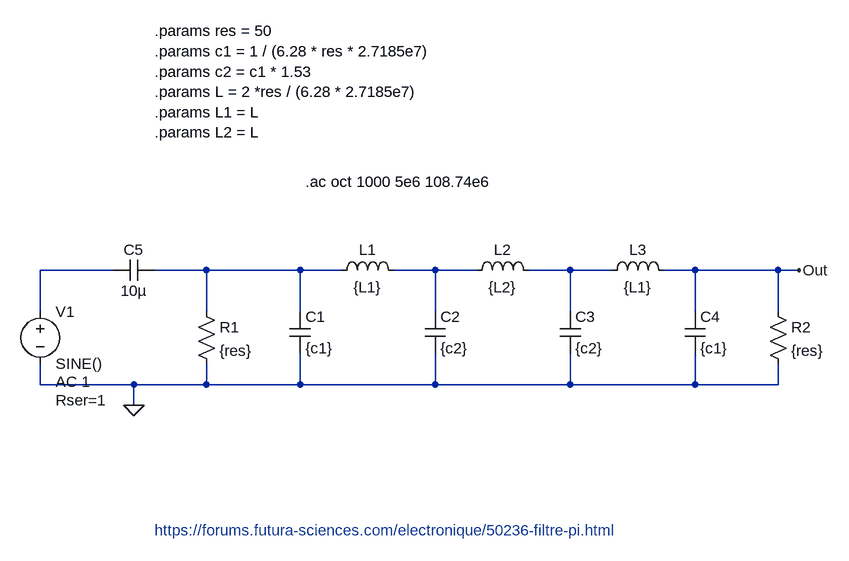
[diagram p0: schematic PiFilter-1.asc]
PiFilter-1.asc, the LTspice schematic file:
Version 4
SHEET 1 1020 680
WIRE -96 32 -208 32
WIRE 48 32 -32 32
WIRE 192 32 48 32
WIRE 256 32 192 32
WIRE 400 32 336 32
WIRE 464 32 400 32
WIRE 608 32 544 32
WIRE 672 32 608 32
WIRE 800 32 752 32
WIRE 928 32 800 32
WIRE 960 32 928 32
WIRE -208 96 -208 32
WIRE 48 96 48 32
WIRE 192 96 192 32
WIRE 400 96 400 32
WIRE 608 96 608 32
WIRE 800 96 800 32
WIRE 928 96 928 32
WIRE -208 208 -208 176
WIRE -64 208 -208 208
WIRE 48 208 48 176
WIRE 48 208 -64 208
WIRE 192 208 192 160
WIRE 192 208 48 208
WIRE 400 208 400 160
WIRE 400 208 192 208
WIRE 608 208 608 160
WIRE 608 208 400 208
WIRE 800 208 800 160
WIRE 800 208 608 208
WIRE 928 208 928 176
WIRE 928 208 800 208
WIRE -64 240 -64 208
FLAG -64 240 0
FLAG 960 32 Out
SYMBOL cap 176 96 R0
SYMATTR InstName C1
SYMATTR Value {c1}
SYMBOL cap 384 96 R0
SYMATTR InstName C2
SYMATTR Value {c2}
SYMBOL cap 592 96 R0
SYMATTR InstName C3
SYMATTR Value {c2}
SYMBOL cap 784 96 R0
SYMATTR InstName C4
SYMATTR Value {c1}
SYMBOL ind 240 48 R270
WINDOW 0 32 56 VTop 2
WINDOW 3 5 56 VBottom 2
SYMATTR InstName L1
SYMATTR Value {L1}
SYMBOL ind 448 48 R270
WINDOW 0 32 56 VTop 2
WINDOW 3 5 56 VBottom 2
SYMATTR InstName L2
SYMATTR Value {L2}
SYMBOL ind 656 48 R270
WINDOW 0 32 56 VTop 2
WINDOW 3 5 56 VBottom 2
SYMATTR InstName L3
SYMATTR Value {L1}
SYMBOL res 32 80 R0
SYMATTR InstName R1
SYMATTR Value {res}
SYMBOL res 912 80 R0
SYMATTR InstName R2
SYMATTR Value {res}
SYMBOL cap -32 16 R90
WINDOW 0 0 32 VBottom 2
WINDOW 3 32 32 VTop 2
SYMATTR InstName C5
SYMATTR Value 10µ
SYMBOL voltage -208 80 R0
WINDOW 123 24 124 Left 2
WINDOW 39 24 152 Left 2
SYMATTR Value2 AC 1
SYMATTR SpiceLine Rser=1
SYMATTR InstName V1
SYMATTR Value SINE()
TEXT -32 432 Left 2 ;https://forums.futura-sciences.com/electronique/50236-filtre-pi.html
TEXT -32 -336 Left 2 !.params res = 50\n.params c1 = 1 / (6.28 * res * 2.7185e7)\n.params c2 = c1 * 1.53\n.params L = 2 *res / (6.28 * 2.7185e7)\n.params L1 = L\n.params L2 = L
TEXT 200 -104 Left 2 !.ac oct 1000 5e6 108.74e6

The netlist it stands for:
* PiFilter-1.asc
C1 N002 0 {c1}
C2 N003 0 {c2}
C3 N004 0 {c2}
C4 Out 0 {c1}
L1 N002 N003 {L1}
L2 N003 N004 {L2}
L3 N004 Out {L1}
R1 N002 0 {res}
R2 Out 0 {res}
C5 N002 N001 10µ
V1 N001 0 SINE() AC 1 Rser=1
* https://forums.futura-sciences.com/electronique/50236-filtre-pi.html
.params res = 50
.params c1 = 1 / (6.28 * res * 2.7185e7)
.params c2 = c1 * 1.53
.params L = 2 *res / (6.28 * 2.7185e7)
.params L1 = L
.params L2 = L
.ac oct 1000 5e6 108.74e6
.backanno
.end